# EAGLE design audio-amp (EAGLE 6.5.0)
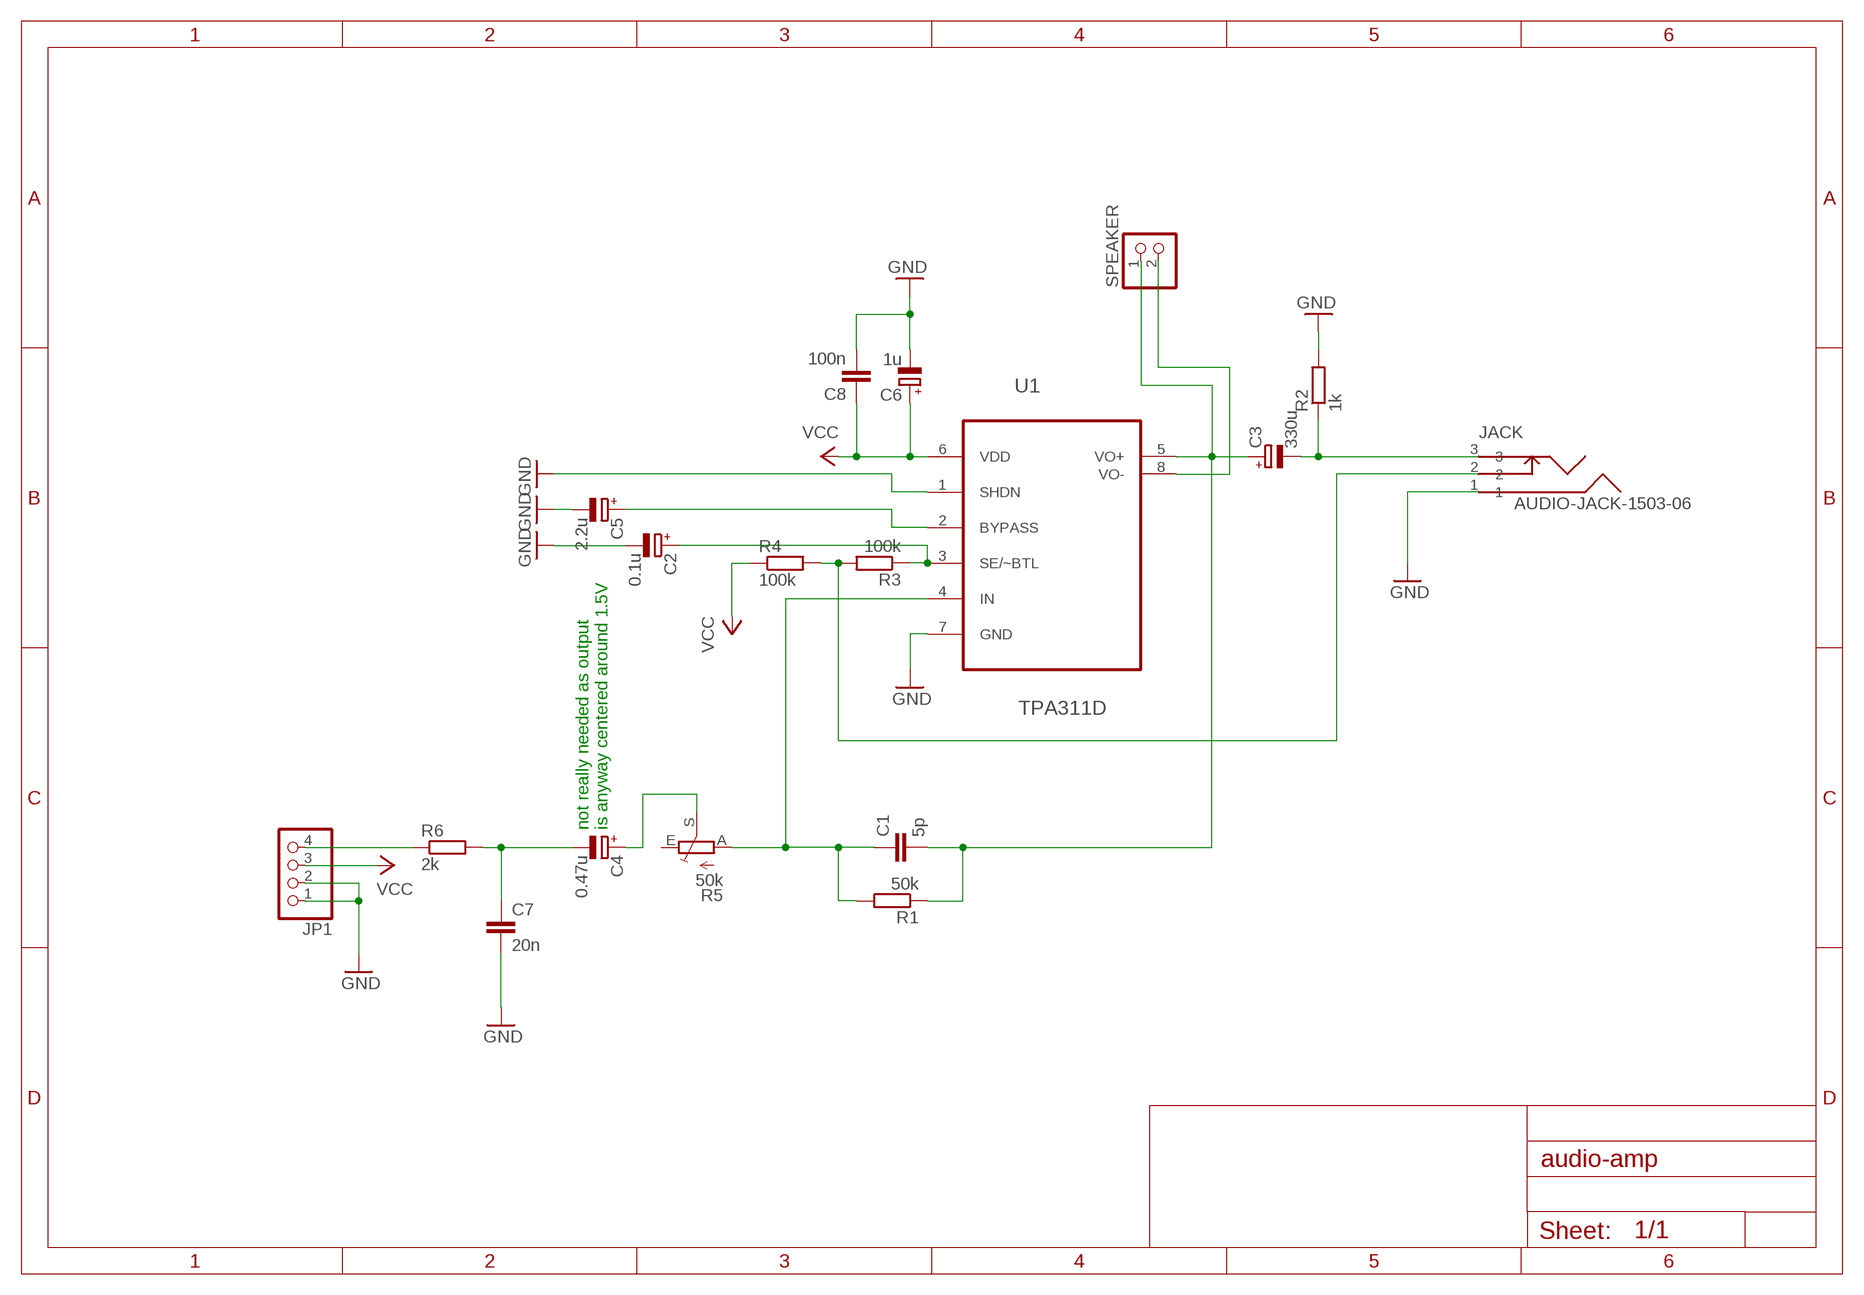
[diagram p0: schematic, sheet 1]

## Parts
C1  5p  C-EUC0805  [C0805]
C2  0.1u  CPOL-EUE2-5  [E2-5]
C3  330u  CPOL-EUE2-5  [E2-5]
C4  0.47u  CPOL-EUE2-5  [E2-5]
C5  2.2u  CPOL-EUE2-5  [E2-5]
C6  1u  CPOL-EUE2-5  [E2-5]
C7  20n  C-EUC0805  [C0805]
C8  100n  C-EUC0805  [C0805]
JACK  AUDIO-JACK-1503-06  [AUDIO-JACK]
JP1  PINHD-1X4  [1X04]
R1  50k  R-EU_R0805  [R0805]
R2  1k  R-EU_R0805  [R0805]
R3  100k  R-EU_R0805  [R0805]
R4  100k  R-EU_R0805  [R0805]
R5  50k  TRIM_EU-PT10  [PT-10]
R6  2k  R-EU_R0805  [R0805]
SPEAKER  PINHD-1X2  [1X02]
U1  TPA311D  [SOIC127P600X175-8N]

## Nets
GND: C2.- C5.- C6.- C7.2 C8.2 JACK.1 JP1.1 JP1.2 R2.2 U1.1(SHDN) U1.7(GND)
N$1: C1.2 C3.+ R1.1 SPEAKER.1 U1.5(VO+)
N$2: C3.- JACK.3 R2.1
N$3: JACK.2 R3.2 R4.2
N$4: C2.+ R3.1 U1.3(SE/~BTL)
N$5: C1.1 R1.2 R5.A U1.4(IN)
N$6: JP1.4 R6.1
N$7: C5.+ U1.2(BYPASS)
N$8: C4.- C7.1 R6.2
N$9: SPEAKER.2 U1.8(VO-)
N$10: C4.+ R5.S
VCC: C6.+ C8.1 JP1.3 R4.1 U1.6(VDD)
Unconnected: R5.E

## Notes on the sheet
- not really needed as output
  is anyway centered around 1.5V

## Library data of the parts
C1 C7 C8 = rcl:C-EU: CAPACITOR, European symbol
C2-C6 = rcl:CPOL-EU: POLARIZED CAPACITOR, European symbol
JACK = audio-jack:AUDIO-JACK-1503-06
JP1 = pinhead:PINHD-1X4: PIN HEADER
R1-R4 R6 = rcl:R-EU_: RESISTOR, European symbol
R5 = pot:TRIM_EU-: POTENTIOMETER
SPEAKER = pinhead:PINHD-1X2: PIN HEADER
U1 = Texas Instruments_By_element14_Batch_1:TPA311D: 350-mW MONO AUDIO POWER AMPLIFIER; MPN: TPA311D; OC_FARNELL: 1575682; OC_NEWARK: 76C9800; PACKAGE: SOIC-8; SUPPLIER: Texas Instruments

## Board
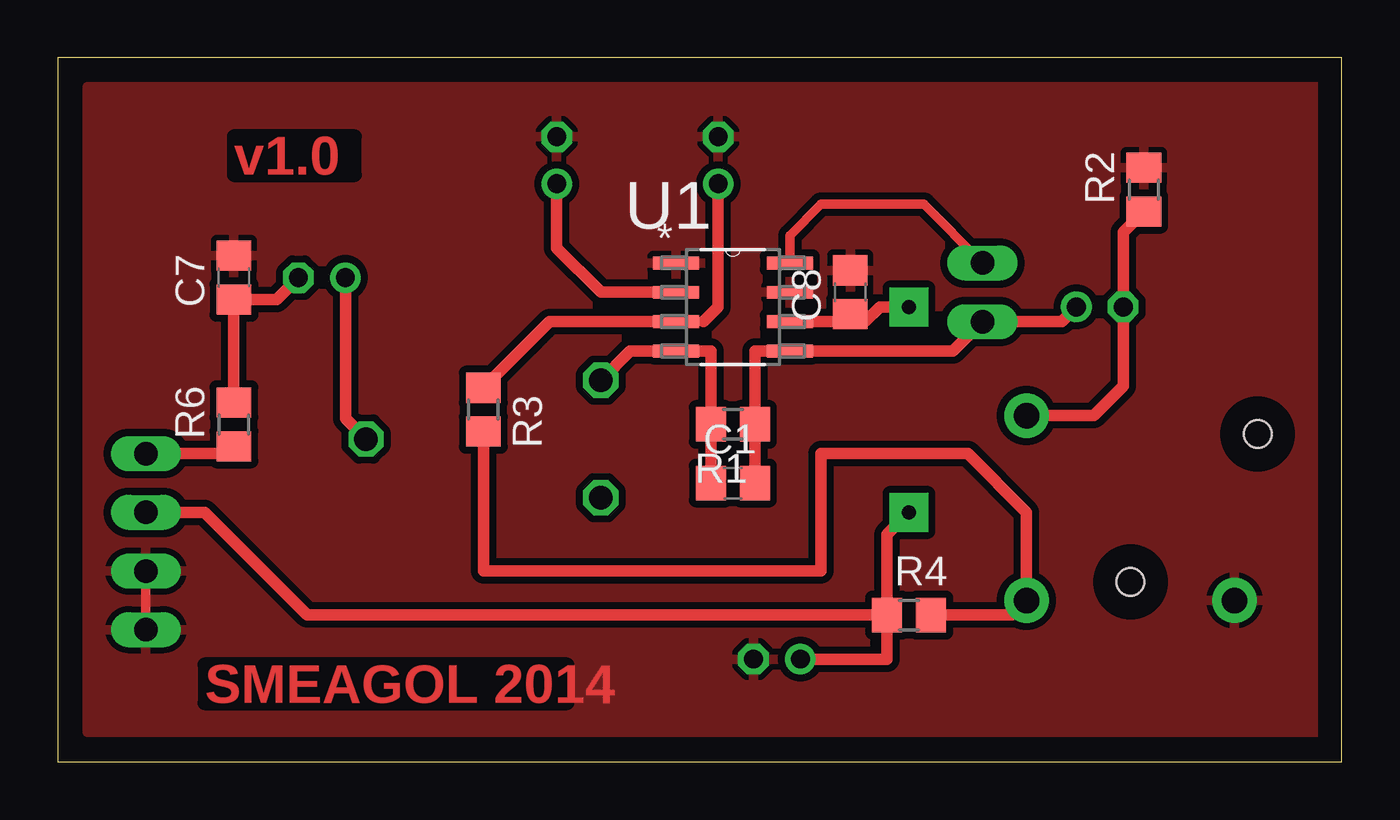
[diagram p1: board, top side]
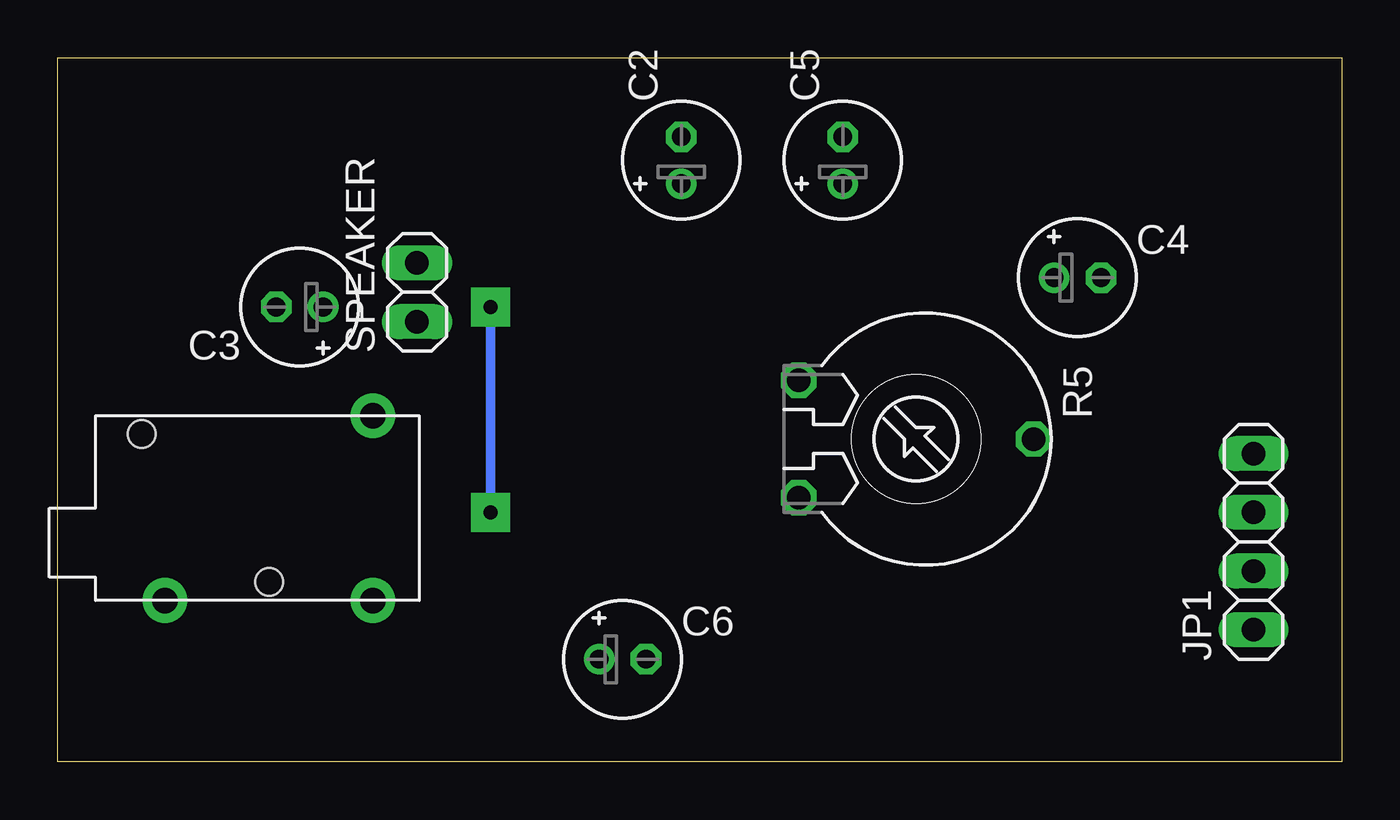
[diagram p2: board, bottom side, seen from below]

Size 55.55 x 30.47 mm. Coordinates in mm from the lower left corner, seen from the top.
Outline: 0,0 55.55,0 55.55,30.47 0,30.47 0,0
Copper layers (1*16): Top 0.035mm / dielectric 1.5mm / Bottom 0.035mm
Design rules "default *": minimum track width 10mil, minimum drill 24mil, track to track 12mil, track to pad 12mil, pad to pad 8mil, via to via 8mil, smd to smd 8mil, copper to edge 40mil, drill to drill 8mil, minimum pad ring 10mil, minimum via ring 8mil, stop-mask expansion 4mil, vias tented up to drill 0mil, thermal gap 10mil

### Footprints (pad centres in the part's own frame; a part is rotated, then mirrored left to right if it is on the bottom)
C0805 = smd 1.3 x 1.5: 1 -0.95,0; 2 0.95,0
E2-5 = drill 0.813 pad 1.27: + -1.016,0 | drill 0.813 pad 1.27 octagon: - 1.016,0
AUDIO-JACK = drill 1.1 pad 1.93: 1 9,0; 2 0,0; 3 0,-8 | hole 1.2: 4.5,-0.8; 10,-7.2
1X04 = drill 1.016 long: 1 -3.81,0; 2 -1.27,0; 3 1.27,0; 4 3.81,0
R0805 = smd 1.3 x 1.5: 1 -0.95,0; 2 0.95,0
PT-10 = drill 1.016 octagon: A -2.54,-5.08; E 2.54,-5.08; S 0,5.08
1X02 = drill 1.016 long: 1 -1.27,0; 2 1.27,0
SOIC127P600X175-8N = smd 1.981 x 0.559: 1 -2.464,1.905; 2 -2.464,0.635; 3 -2.464,-0.635; 4 -2.464,-1.905; 5 2.464,-1.905; 6 2.464,-0.635; 7 2.464,0.635; 8 2.464,1.905

### Placement (x,y rotation side)
C1  29.21,12.06 0 top
C2  28.58,26.04 90 bottom
C3  45.09,19.68 180 bottom
C4  11.43,20.95 0 bottom
C5  21.59,26.04 90 bottom
C6  31.12,4.45 0 bottom
C7  7.62,20.95 90 top
C8  34.29,20.32 90 top
JACK  41.91,6.99 180 bottom
JP1  3.81,9.53 90 bottom
R1  29.21,14.61 180 top
R2  46.99,24.77 90 top
R3  18.41,15.24 270 top
R4  36.83,6.35 0 top
R5  18.41,13.97 270 bottom
R6  7.62,14.61 90 top
SPEAKER  40.01,20.32 90 bottom
U1  29.21,19.68 0 top

### Tracks (layer width: path | path; a pad name or v marks a point on that pad's centre or on a via)
GND
  Top 0.406: JP1.1 JP1.2
  pour Top: 1.27,1.27 1.27,29.21 54.61,29.21 54.61,1.27
N$1
  Top 0.5: C1.2 R1.1 30.16,17.78 U1.5 38.73,17.78 SPEAKER.1 43.43,19.05 C3.+
N$2
  Top 0.5: R2.1 46.1,22.93 C3.- 46.1,16.26 44.83,14.98 JACK.3
N$3
  Top 0.5: R4.2 41.27,6.35 JACK.2 41.91,10.79 39.37,13.34 33.02,13.34 33.02,8.26 18.41,8.26 R3.2
N$4
  Top 0.406: U1.3 27.94,19.05
  Top 0.5: 27.94,19.05 28.58,19.68 C2.+ | R3.1 21.27,19.05 U1.3
N$5
  Top 0.5: C1.1 R1.2 28.26,17.78 U1.4 24.77,17.78 R5.A
N$6
  Top 0.406: 7.3,13.34 arc90 R6.1
  Top 0.5: JP1.4 7.3,13.34
N$7
  Top 0.5: U1.2 23.49,20.32 21.59,22.23 C5.+
N$8
  Top 0.5: R6.2 C7.1 9.46,20 C4.-
N$9
  Top 0.406: U1.8 31.67,22.78 33.02,24.13 37.47,24.13 SPEAKER.2
N$10
  Top 0.5: C4.+ 12.45,14.86 R5.S
VCC  (via drill 0.6 pad 1.68)
  Top 0.406: 34.93,19.05 34.29,19.05 C8.1
  Top 0.5: v36.83,10.79 35.88,9.85 R4.1 | R4.1 10.79,6.35 6.35,10.79 JP1.3 | U1.6 34.93,19.05 35.56,19.68 v36.83,19.68 | C6.+ 35.88,4.45 R4.1
  Bottom 0.406: v36.83,19.68 v36.83,10.79

### Text on the board
Top: v1.0 | SMEAGOL 2014